# EAGLE schematic Basic Sensor Board (EAGLE 7.5.0)
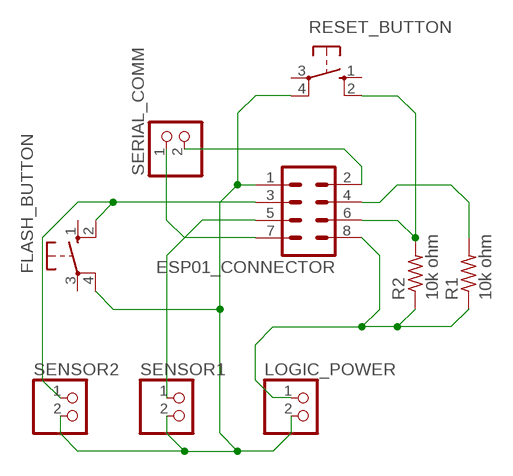
[diagram p0: schematic, sheet 1]

## Parts
ESP01_CONNECTOR  MA04-2  [MA04-2]
FLASH_BUTTON  10-XX  [B3F-10XX]
LOGIC_POWER  PINHD-1X2  [1X02]
R1  10k ohm  R-US_0204/7  [0204/7]
R2  10k ohm  R-US_0204/7  [0204/7]
RESET_BUTTON  10-XX  [B3F-10XX]
SENSOR1  PINHD-1X2  [1X02]
SENSOR2  PINHD-1X2  [1X02]
SERIAL_COMM  PINHD-1X2  [1X02]

## Nets
N$1: ESP01_CONNECTOR.1 FLASH_BUTTON.4(P1) LOGIC_POWER.2 RESET_BUTTON.4(P1) SENSOR1.2 SENSOR2.2
N$2: ESP01_CONNECTOR.4 R1.2
N$3: ESP01_CONNECTOR.8 LOGIC_POWER.1 R1.1 R2.1
N$4: ESP01_CONNECTOR.2 SERIAL_COMM.2
N$5: ESP01_CONNECTOR.6 R2.2 RESET_BUTTON.2(S1)
N$6: ESP01_CONNECTOR.7 SERIAL_COMM.1
N$7: ESP01_CONNECTOR.3 FLASH_BUTTON.2(S1) SENSOR2.1
N$9: ESP01_CONNECTOR.5 SENSOR1.1
Unconnected: FLASH_BUTTON.1(S) FLASH_BUTTON.3(P) RESET_BUTTON.1(S) RESET_BUTTON.3(P)

## Library data of the parts
ESP01_CONNECTOR = con-lstb:MA04-2: PIN HEADER; OC_FARNELL: unknown; OC_NEWARK: unknown
FLASH_BUTTON RESET_BUTTON = switch-omron:10-XX: OMRON SWITCH; MPN: B3F-1000; OC_FARNELL: 176432; OC_NEWARK: 36M3542
LOGIC_POWER SENSOR1 SENSOR2 SERIAL_COMM = pinhead:PINHD-1X2: PIN HEADER
R1 R2 = resistor:R-US_: RESISTOR, American symbol